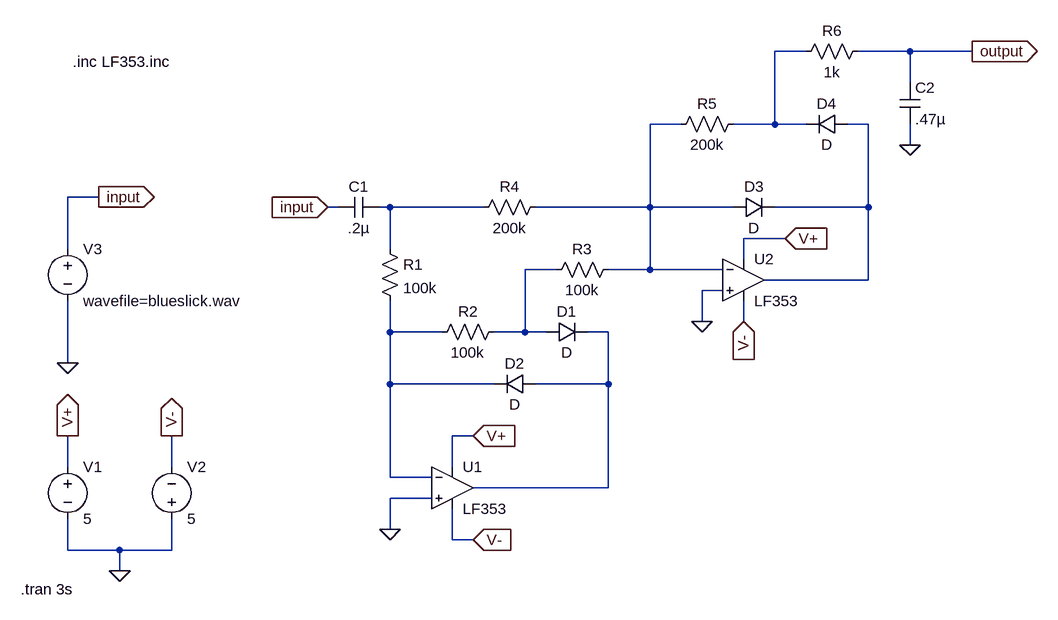
[diagram p0: schematic Envelope Detector.asc]
Envelope Detector.asc, the LTspice schematic file:
Version 4
SHEET 1 1088 680
WIRE 656 -400 608 -400
WIRE 816 -400 736 -400
WIRE 912 -400 816 -400
WIRE 816 -352 816 -400
WIRE 464 -288 416 -288
WIRE 608 -288 608 -400
WIRE 608 -288 544 -288
WIRE 656 -288 608 -288
WIRE 752 -288 720 -288
WIRE 816 -256 816 -288
WIRE -432 -176 -480 -176
WIRE -64 -160 -80 -160
WIRE 16 -160 0 -160
WIRE 160 -160 16 -160
WIRE 416 -160 416 -288
WIRE 416 -160 240 -160
WIRE 544 -160 416 -160
WIRE 752 -160 752 -288
WIRE 752 -160 608 -160
WIRE 624 -112 560 -112
WIRE -480 -96 -480 -176
WIRE 16 -96 16 -160
WIRE 560 -80 560 -112
WIRE 272 -64 224 -64
WIRE 416 -64 416 -160
WIRE 416 -64 352 -64
WIRE 528 -64 416 -64
WIRE 752 -48 752 -160
WIRE 752 -48 592 -48
WIRE 528 -32 496 -32
WIRE 496 16 496 -32
WIRE 560 16 560 -16
WIRE 16 32 16 -16
WIRE 96 32 16 32
WIRE 224 32 224 -64
WIRE 224 32 176 32
WIRE 256 32 224 32
WIRE 352 32 320 32
WIRE -480 80 -480 -16
WIRE 16 112 16 32
WIRE 176 112 16 112
WIRE 352 112 352 32
WIRE 352 112 240 112
WIRE 144 192 112 192
WIRE -480 240 -480 192
WIRE -320 240 -320 192
WIRE 112 240 112 192
WIRE 16 256 16 112
WIRE 80 256 16 256
WIRE 352 272 352 112
WIRE 352 272 144 272
WIRE 80 288 16 288
WIRE 16 336 16 288
WIRE 112 352 112 304
WIRE 144 352 112 352
WIRE -480 368 -480 320
WIRE -400 368 -480 368
WIRE -320 368 -320 320
WIRE -320 368 -400 368
WIRE -400 400 -400 368
FLAG -80 -160 input
IOPIN -80 -160 In
FLAG 16 336 0
FLAG 496 16 0
FLAG 912 -400 output
IOPIN 912 -400 Out
FLAG 816 -256 0
FLAG 144 352 V-
IOPIN 144 352 In
FLAG 144 192 V+
IOPIN 144 192 In
FLAG 624 -112 V+
IOPIN 624 -112 In
FLAG 560 16 V-
IOPIN 560 16 In
FLAG -400 400 0
FLAG -480 192 V+
IOPIN -480 192 Out
FLAG -320 192 V-
IOPIN -320 192 Out
FLAG -480 80 0
FLAG -432 -176 input
IOPIN -432 -176 Out
SYMBOL cap 0 -176 R90
WINDOW 0 0 32 VBottom 2
WINDOW 3 32 32 VTop 2
SYMATTR InstName C1
SYMATTR Value .2µ
SYMBOL res 256 -176 R90
WINDOW 0 0 56 VBottom 2
WINDOW 3 32 56 VTop 2
SYMATTR InstName R4
SYMATTR Value 200k
SYMBOL res 0 -112 R0
SYMATTR InstName R1
SYMATTR Value 100k
SYMBOL res 192 16 R90
WINDOW 0 0 56 VBottom 2
WINDOW 3 32 56 VTop 2
SYMATTR InstName R2
SYMATTR Value 100k
SYMBOL diode 256 48 R270
WINDOW 0 32 32 VTop 2
WINDOW 3 0 32 VBottom 2
SYMATTR InstName D1
SYMBOL res 368 -80 R90
WINDOW 0 0 56 VBottom 2
WINDOW 3 32 56 VTop 2
SYMATTR InstName R3
SYMATTR Value 100k
SYMBOL diode 240 96 R90
WINDOW 0 0 32 VBottom 2
WINDOW 3 32 32 VTop 2
SYMATTR InstName D2
SYMBOL Opamps\\opamp2 112 208 R0
SYMATTR InstName U1
SYMATTR Value LF353
SYMBOL Opamps\\opamp2 560 -112 R0
SYMATTR InstName U2
SYMATTR Value LF353
SYMBOL diode 544 -144 R270
WINDOW 0 32 32 VTop 2
WINDOW 3 0 32 VBottom 2
SYMATTR InstName D3
SYMBOL res 560 -304 R90
WINDOW 0 0 56 VBottom 2
WINDOW 3 32 56 VTop 2
SYMATTR InstName R5
SYMATTR Value 200k
SYMBOL diode 720 -304 R90
WINDOW 0 0 32 VBottom 2
WINDOW 3 32 32 VTop 2
SYMATTR InstName D4
SYMBOL res 752 -416 R90
WINDOW 0 0 56 VBottom 2
WINDOW 3 32 56 VTop 2
SYMATTR InstName R6
SYMATTR Value 1k
SYMBOL cap 800 -352 R0
SYMATTR InstName C2
SYMATTR Value .47µ
SYMBOL voltage -480 224 R0
WINDOW 123 0 0 Left 2
WINDOW 39 0 0 Left 2
SYMATTR InstName V1
SYMATTR Value 5
SYMBOL voltage -320 336 M180
WINDOW 0 24 96 Left 2
WINDOW 3 24 16 Left 2
WINDOW 123 0 0 Left 2
WINDOW 39 0 0 Left 2
SYMATTR InstName V2
SYMATTR Value 5
SYMBOL voltage -480 -112 R0
SYMATTR InstName V3
SYMATTR Value wavefile=blueslick.wav
TEXT -472 -384 Left 2 !.inc LF353.inc
TEXT -552 428 Left 2 !.tran 3s

The netlist it stands for:
* Envelope Detector.asc
C1 N004 input .2µ
R4 N002 N004 200k
R1 N004 N006 100k
R2 N005 N006 100k
D1 N005 N007 D
R3 N002 N005 100k
D2 N007 N006 D
XU1 0 N006 V+ V- N007 LF353  ; pins In+ In- V+ V- OUT
XU2 0 N002 V+ V- N003 LF353  ; pins In+ In- V+ V- OUT
D3 N002 N003 D
R5 N001 N002 200k
D4 N003 N001 D
R6 output N001 1k
C2 output 0 .47µ
V1 V+ 0 5
V2 0 V- 5
V3 input 0 wavefile=blueslick.wav
.model D D
.lib standard.dio
.inc LF353.inc
.tran 3s
.backanno
.end